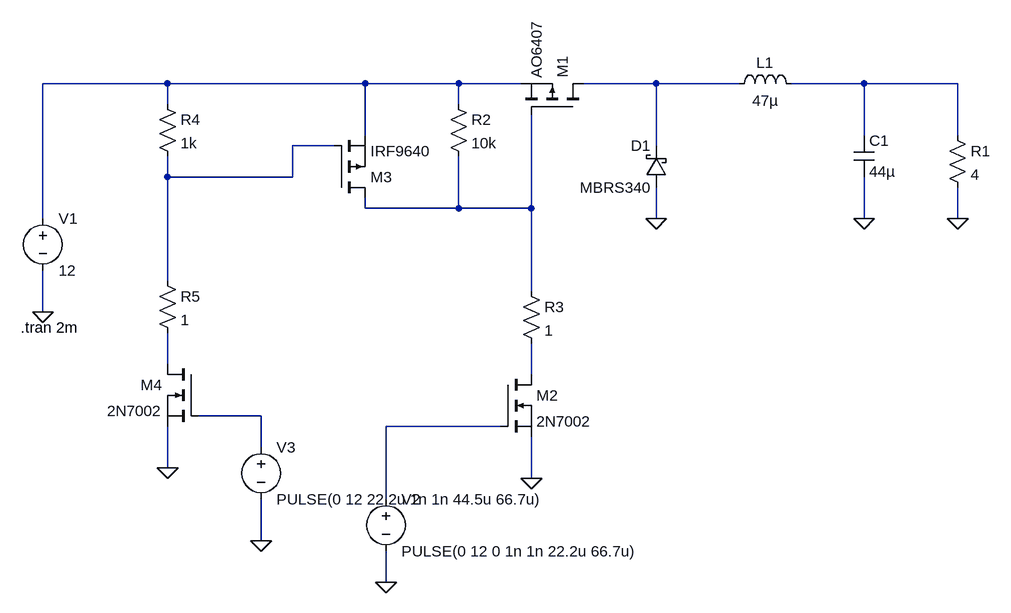
[diagram p0: schematic Gate Drive Circuit2.asc]
Gate Drive Circuit2.asc, the LTspice schematic file:
Version 4
SHEET 1 1176 724
WIRE -96 -64 -288 -64
WIRE 208 -64 -96 -64
WIRE 352 -64 208 -64
WIRE 448 -64 352 -64
WIRE 656 -64 544 -64
WIRE 784 -64 656 -64
WIRE 976 -64 864 -64
WIRE 1120 -64 976 -64
WIRE -96 -32 -96 -64
WIRE 352 -32 352 -64
WIRE 208 16 208 -64
WIRE 976 16 976 -64
WIRE 1120 16 1120 -64
WIRE 160 32 96 32
WIRE 656 32 656 -64
WIRE -96 80 -96 48
WIRE 96 80 96 32
WIRE 96 80 -96 80
WIRE 208 128 208 112
WIRE 352 128 352 48
WIRE 352 128 208 128
WIRE 464 128 464 -16
WIRE 464 128 352 128
WIRE -288 144 -288 -64
WIRE 656 144 656 96
WIRE 976 144 976 80
WIRE 1120 144 1120 96
WIRE -96 240 -96 80
WIRE 464 256 464 128
WIRE -288 288 -288 224
WIRE -96 368 -96 320
WIRE 464 384 464 336
WIRE 48 448 -48 448
WIRE 416 464 240 464
WIRE 48 496 48 448
WIRE -96 528 -96 464
WIRE 464 544 464 480
WIRE 240 576 240 464
WIRE 48 640 48 576
WIRE 240 704 240 656
FLAG -288 288 0
FLAG 656 144 0
FLAG 976 144 0
FLAG 1120 144 0
FLAG 240 704 0
FLAG 464 544 0
FLAG -96 528 0
FLAG 48 640 0
SYMBOL voltage -288 128 R0
WINDOW 123 0 0 Left 0
WINDOW 39 0 0 Left 0
SYMATTR InstName V1
SYMATTR Value 12
SYMBOL voltage 240 560 R0
WINDOW 123 0 0 Left 0
WINDOW 39 0 0 Left 0
SYMATTR InstName V2
SYMATTR Value PULSE(0 12 0 1n 1n 22.2u 66.7u)
SYMBOL pmos 544 -16 M270
SYMATTR InstName M1
SYMATTR Value AO6407
SYMBOL schottky 672 96 R180
WINDOW 0 24 64 Left 2
WINDOW 3 24 0 Left 2
SYMATTR InstName D1
SYMATTR Value MBRS340
SYMATTR Description Diode
SYMATTR Type diode
SYMBOL ind 768 -48 R270
WINDOW 0 32 56 VTop 2
WINDOW 3 5 56 VBottom 2
SYMATTR InstName L1
SYMATTR Value 47µ
SYMBOL cap 960 16 R0
SYMATTR InstName C1
SYMATTR Value 44µ
SYMBOL res 1104 0 R0
SYMATTR InstName R1
SYMATTR Value 4
SYMBOL nmos 416 384 R0
SYMATTR InstName M2
SYMATTR Value 2N7002
SYMBOL res 336 -48 R0
SYMATTR InstName R2
SYMATTR Value 10k
SYMBOL res 448 240 R0
SYMATTR InstName R3
SYMATTR Value 1
SYMBOL pmos 160 112 M180
SYMATTR InstName M3
SYMATTR Value IRF9640
SYMBOL res -112 -48 R0
SYMATTR InstName R4
SYMATTR Value 1k
SYMBOL nmos -48 368 M0
SYMATTR InstName M4
SYMATTR Value 2N7002
SYMBOL voltage 48 480 R0
WINDOW 123 0 0 Left 0
WINDOW 39 0 0 Left 0
SYMATTR InstName V3
SYMATTR Value PULSE(0 12 22.2u 1n 1n 44.5u 66.7u)
SYMBOL res -112 224 R0
SYMATTR InstName R5
SYMATTR Value 1
TEXT -322 312 Left 2 !.tran 2m

The netlist it stands for:
* Gate Drive Circuit2.asc
V1 N001 0 12
V2 N009 0 PULSE(0 12 0 1n 1n 22.2u 66.7u)
M1 N002 N005 N001 N001 AO6407
D1 0 N002 MBRS340
L1 N002 N003 47µ
C1 N003 0 44µ
R1 N003 0 4
M2 N007 N009 0 0 2N7002
R2 N001 N005 10k
R3 N005 N007 1
M3 N005 N004 N001 N001 IRF9640
R4 N001 N004 1k
M4 N006 N008 0 0 2N7002
V3 N008 0 PULSE(0 12 22.2u 1n 1n 44.5u 66.7u)
R5 N004 N006 1
.model D D
.lib standard.dio
.model NMOS NMOS
.model PMOS PMOS
.lib standard.mos
.tran 2m
.backanno
.end